# EAGLE schematic axiom_beta_shield_HDMI_v0.2.b03618a9 (EAGLE 7.7.0)
Assembly variants: Beta

## Sheet 1 of 2
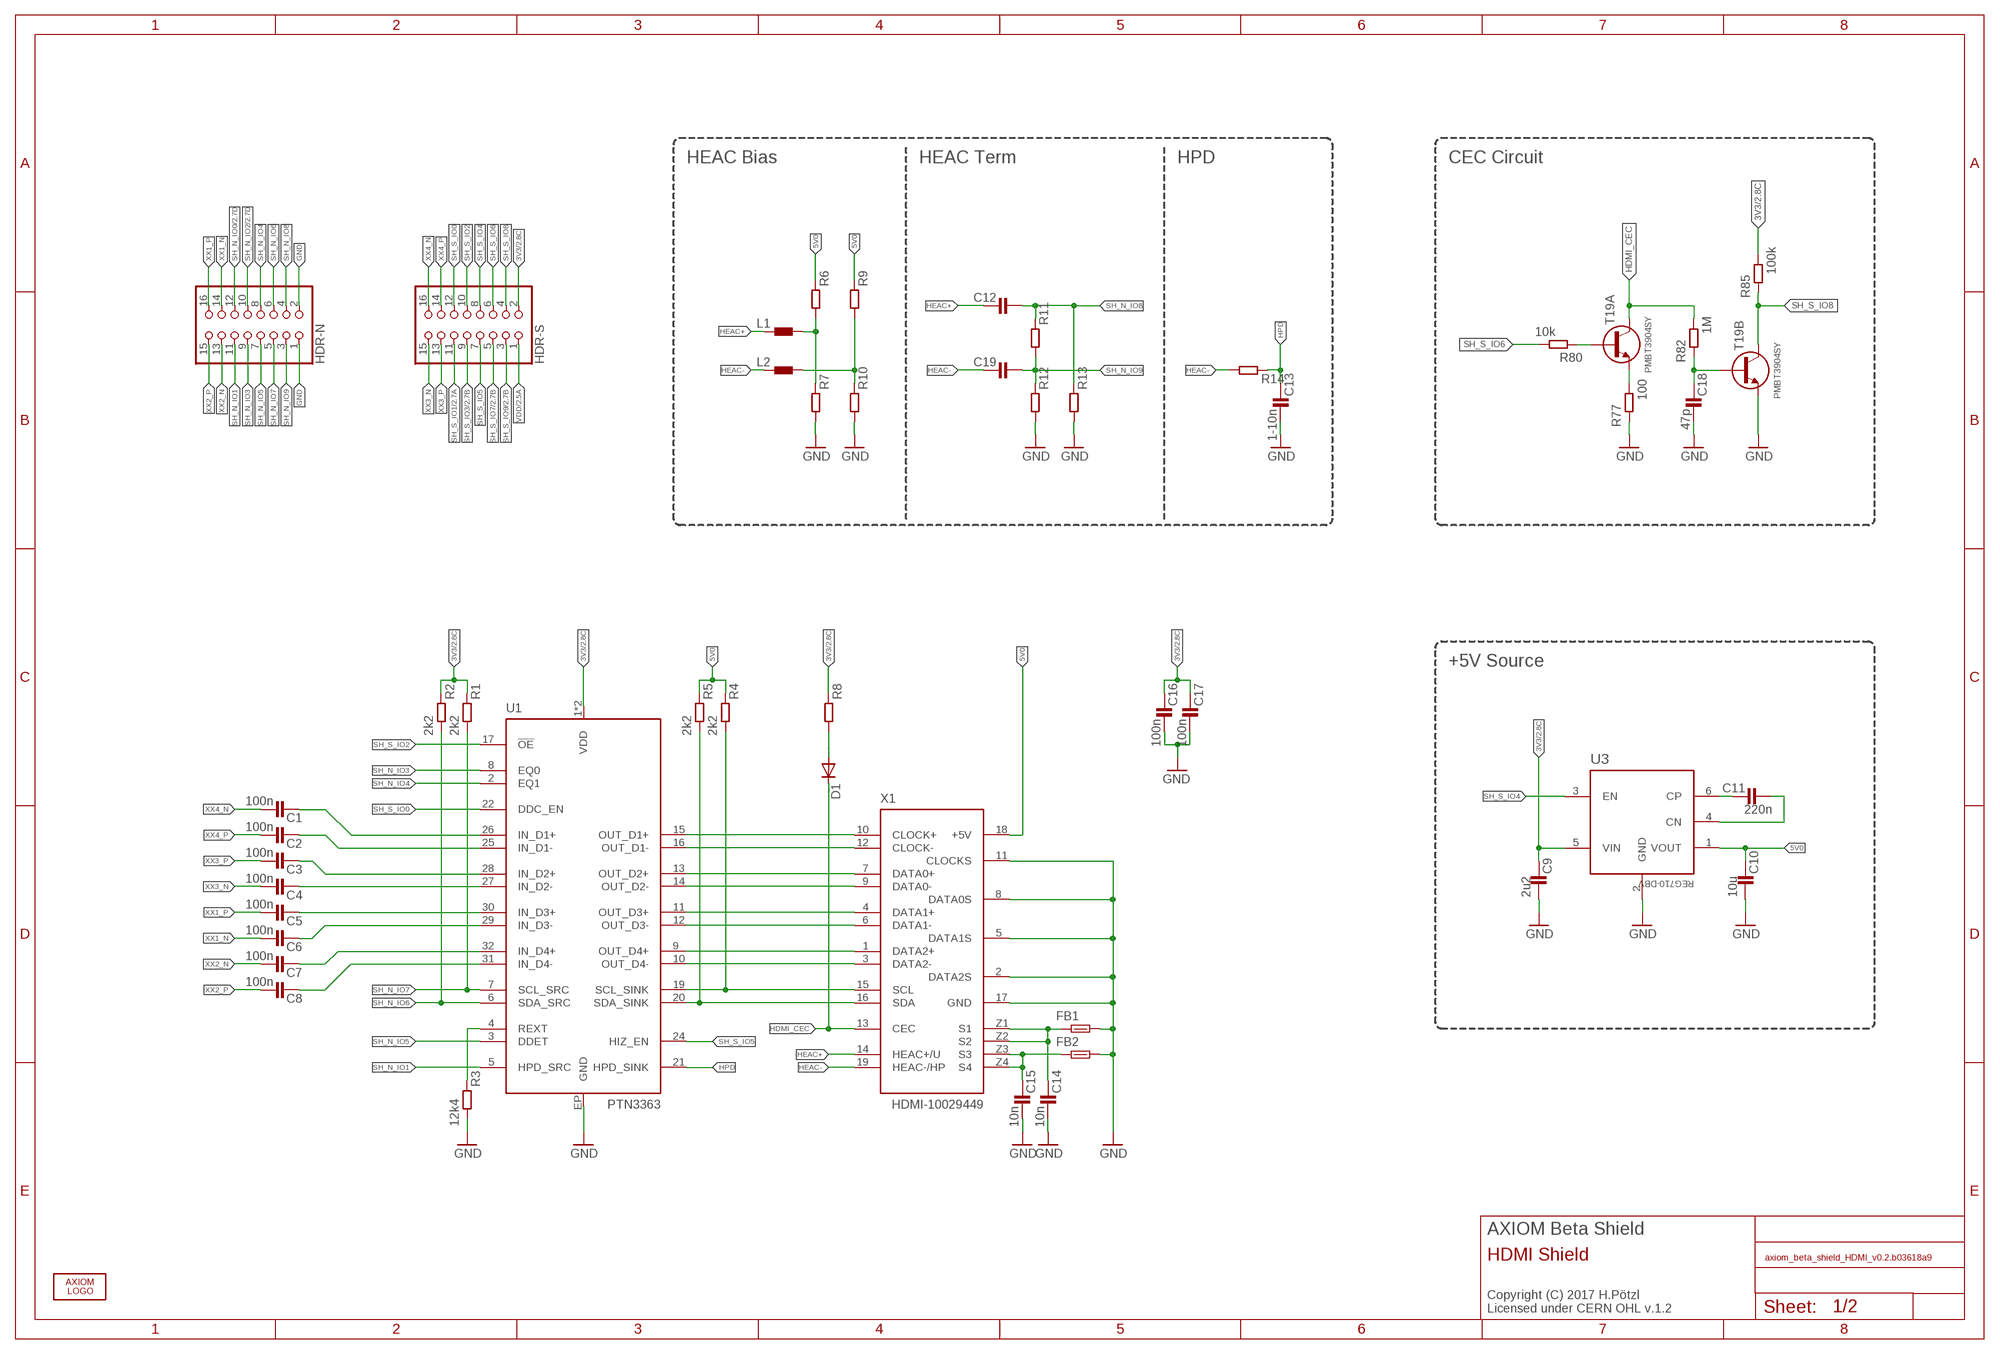
[diagram p0: schematic, sheet 1]

### Parts
C1  100n  C0402-C  [0402-C]
C2  100n  C0402-C  [0402-C]
C3  100n  C0402-C  [0402-C]
C4  100n  C0402-C  [0402-C]
C5  100n  C0402-C  [0402-C]
C6  100n  C0402-C  [0402-C]
C7  100n  C0402-C  [0402-C]
C8  100n  C0402-C  [0402-C]
C9  2u2  C0603-B  [0603-B]
C10  10u  C0603-B  [0603-B]
C11  220n  C0402-B  [0402-B]
C12  C0402-B  [0402-B]  (not fitted in variant Beta)
C13  1-10n  C0402-B  [0402-B]  (not fitted in variant Beta)
C14  10n  C0402-B  [0402-B]
C15  10n  C0402-B  [0402-B]
C16  100n  C0402-B  [0402-B]
C17  100n  C0402-B  [0402-B]
C18  47p  C0402-B  [0402-B]
C19  C0402-B  [0402-B]  (not fitted in variant Beta)
D1  DIODE-SOD523  [SOD523]
FB1  FB0603-B  [0603-B]
FB2  FB0603-B  [0603-B]
HDR-N  PINHD-2X08_2.00_SMD  [2X08M_SMD]  (not fitted in variant Beta)
HDR-S  PINHD-2X08_2.00_SMD  [2X08M_SMD]  (not fitted in variant Beta)
L1  L0402-B  [0402-B]  (not fitted in variant Beta)
L2  L0402-B  [0402-B]  (not fitted in variant Beta)
R1  2k2  R0402-B  [0402-B]
R2  2k2  R0402-B  [0402-B]
R3  12k4  R0402-B  [0402-B]
R4  2k2  R0402-B  [0402-B]
R5  2k2  R0402-B  [0402-B]
R6  R0402-B  [0402-B]  (not fitted in variant Beta)
R7  R0402-B  [0402-B]  (not fitted in variant Beta)
R8  R0402-B  [0402-B]
R9  R0402-B  [0402-B]  (not fitted in variant Beta)
R10  R0402-B  [0402-B]  (not fitted in variant Beta)
R11  R0402-B  [0402-B]  (not fitted in variant Beta)
R12  R0402-B  [0402-B]  (not fitted in variant Beta)
R13  R0402-B  [0402-B]  (not fitted in variant Beta)
R14  R0402-B  [0402-B]  (not fitted in variant Beta)
R77  100  R0402-B  [0402-B]
R80  10k  R0402-B  [0402-B]
R82  1M  R0402-B  [0402-B]
R85  100k  R0402-B  [0402-B]
T19  PMBT3904SY  [SOT363]
U1  PTN3363  [HVQFN32]
U3  REG710-DBV  [DBV]
U$1  AXIOM_LOGO459X70  [AXIOM_LOGO_459X70]
X1  HDMI-10029449  [10029449-X01XLF]

### Nets
3V3: C9.1 C16.1 C17.1 HDR-S.2 R1.1 R2.1 R8.1 R85.2 U1.1(VDD) U1.18(VDD) U3.5(VIN) ; also sheet 2
5V0: C10.1 R4.1 R5.1 R6.1 R9.1 U3.1(VOUT) X1.18(+5V)
CLOCK_N [LVDS]: U1.16(OUT_D1-) X1.12(CLOCK-)
CLOCK_P [LVDS]: U1.15(OUT_D1+) X1.10(CLOCK+)
DATA0_N [LVDS]: U1.14(OUT_D2-) X1.9(DATA0-)
DATA0_P [LVDS]: U1.13(OUT_D2+) X1.7(DATA0+)
DATA1_N [LVDS]: U1.12(OUT_D3-) X1.6(DATA1-)
DATA1_P [LVDS]: U1.11(OUT_D3+) X1.4(DATA1+)
DATA2_N [LVDS]: U1.10(OUT_D4-) X1.3(DATA2-)
DATA2_P [LVDS]: U1.9(OUT_D4+) X1.1(DATA2+)
GND: C9.2 C10.2 C13.2 C14.2 C15.2 C16.2 C17.2 C18.2 FB1.2 FB2.2 HDR-N.1 HDR-N.2 R3.2 R7.2 R10.2 R12.2 R13.2 R77.1 T19.4(B:E) U1.EP(GND) U3.2(GND) X1.2(DATA2S) X1.5(DATA1S) X1.8(DATA0S) X1.11(CLOCKS) X1.17(GND) ; also sheet 2
HDMI_CEC: D1.C R82.2 T19.6(A:C) X1.13(CEC)
HDMI_SCL: R4.2 U1.19(SCL_SINK) X1.15(SCL)
HDMI_SDA: R5.2 U1.20(SDA_SINK) X1.16(SDA)
HEAC+: C12.1 L1.1 X1.14(HEAC+/U)
HEAC-: C19.1 L2.1 R14.2 X1.19(HEAC-/HP)
HPD: C13.1 R14.1 U1.21(HPD_SINK)
IN_D1_N [LVDS]: C2.1 U1.25(IN_D1-)
IN_D1_P [LVDS]: C1.1 U1.26(IN_D1+)
IN_D2_N [LVDS]: C4.1 U1.27(IN_D2-)
IN_D2_P [LVDS]: C3.1 U1.28(IN_D2+)
IN_D3_N [LVDS]: C6.1 U1.29(IN_D3-)
IN_D3_P [LVDS]: C5.1 U1.30(IN_D3+)
IN_D4_N [LVDS]: C8.1 U1.31(IN_D4-)
IN_D4_P [LVDS]: C7.1 U1.32(IN_D4+)
N$1: L1.2 R6.2 R7.1
N$2: L2.2 R9.2 R10.1
N$23: C15.1 FB2.1 X1.Z3(S3) X1.Z4(S4)
N$24: C11.1 U3.6(CP)
N$25: C11.2 U3.4(CN)
N$26: C14.1 FB1.1 X1.Z1(S1) X1.Z2(S2)
N$27: R3.1 U1.4(REXT)
N$45: D1.A R8.2
N$100: R77.2 T19.1(A:E)
N$101: C18.1 R82.1 T19.5(B:B)
N$102: R80.1 T19.2(A:B)
SH_N_IO0: HDR-N.12 ; also sheet 2
SH_N_IO1: HDR-N.11 U1.5(HPD_SRC)
SH_N_IO2: HDR-N.10 ; also sheet 2
SH_N_IO3: HDR-N.9 U1.8(EQ0)
SH_N_IO4: HDR-N.8 U1.2(EQ1)
SH_N_IO5: HDR-N.7 U1.3(DDET)
SH_N_IO6: HDR-N.6 R2.2 U1.6(SDA_SRC)
SH_N_IO7: HDR-N.5 R1.2 U1.7(SCL_SRC)
SH_N_IO8: C12.2 HDR-N.4 R11.1 R13.1
SH_N_IO9: C19.2 HDR-N.3 R11.2 R12.1
SH_S_IO0: HDR-S.12 U1.22(DDC_EN)
SH_S_IO1: HDR-S.11 ; also sheet 2
SH_S_IO2: HDR-S.10 U1.17(!OE!)
SH_S_IO3: HDR-S.9 ; also sheet 2
SH_S_IO4: HDR-S.8 U3.3(EN)
SH_S_IO5: HDR-S.7 U1.24(HIZ_EN)
SH_S_IO6: HDR-S.6 R80.2
SH_S_IO7: HDR-S.5 ; also sheet 2
SH_S_IO8: HDR-S.4 R85.1 T19.3(B:C)
SH_S_IO9: HDR-S.3 ; also sheet 2
VDD: HDR-S.1 ; also sheet 2
XX1_N: C6.2 HDR-N.14
XX1_P: C5.2 HDR-N.16
XX2_N: C7.2 HDR-N.13
XX2_P: C8.2 HDR-N.15
XX3_N: C4.2 HDR-S.15
XX3_P: C3.2 HDR-S.13
XX4_N: C1.2 HDR-S.16
XX4_P: C2.2 HDR-S.14

### Notes on the sheet
- HEAC Bias | HEAC Term | HPD | CEC Circuit
- +5V Source
- AXIOM Beta Shield
- HDMI Shield
- Copyright (C) 2017 H.Pötzl
  Licensed under CERN OHL v.1.2

## Sheet 2 of 2
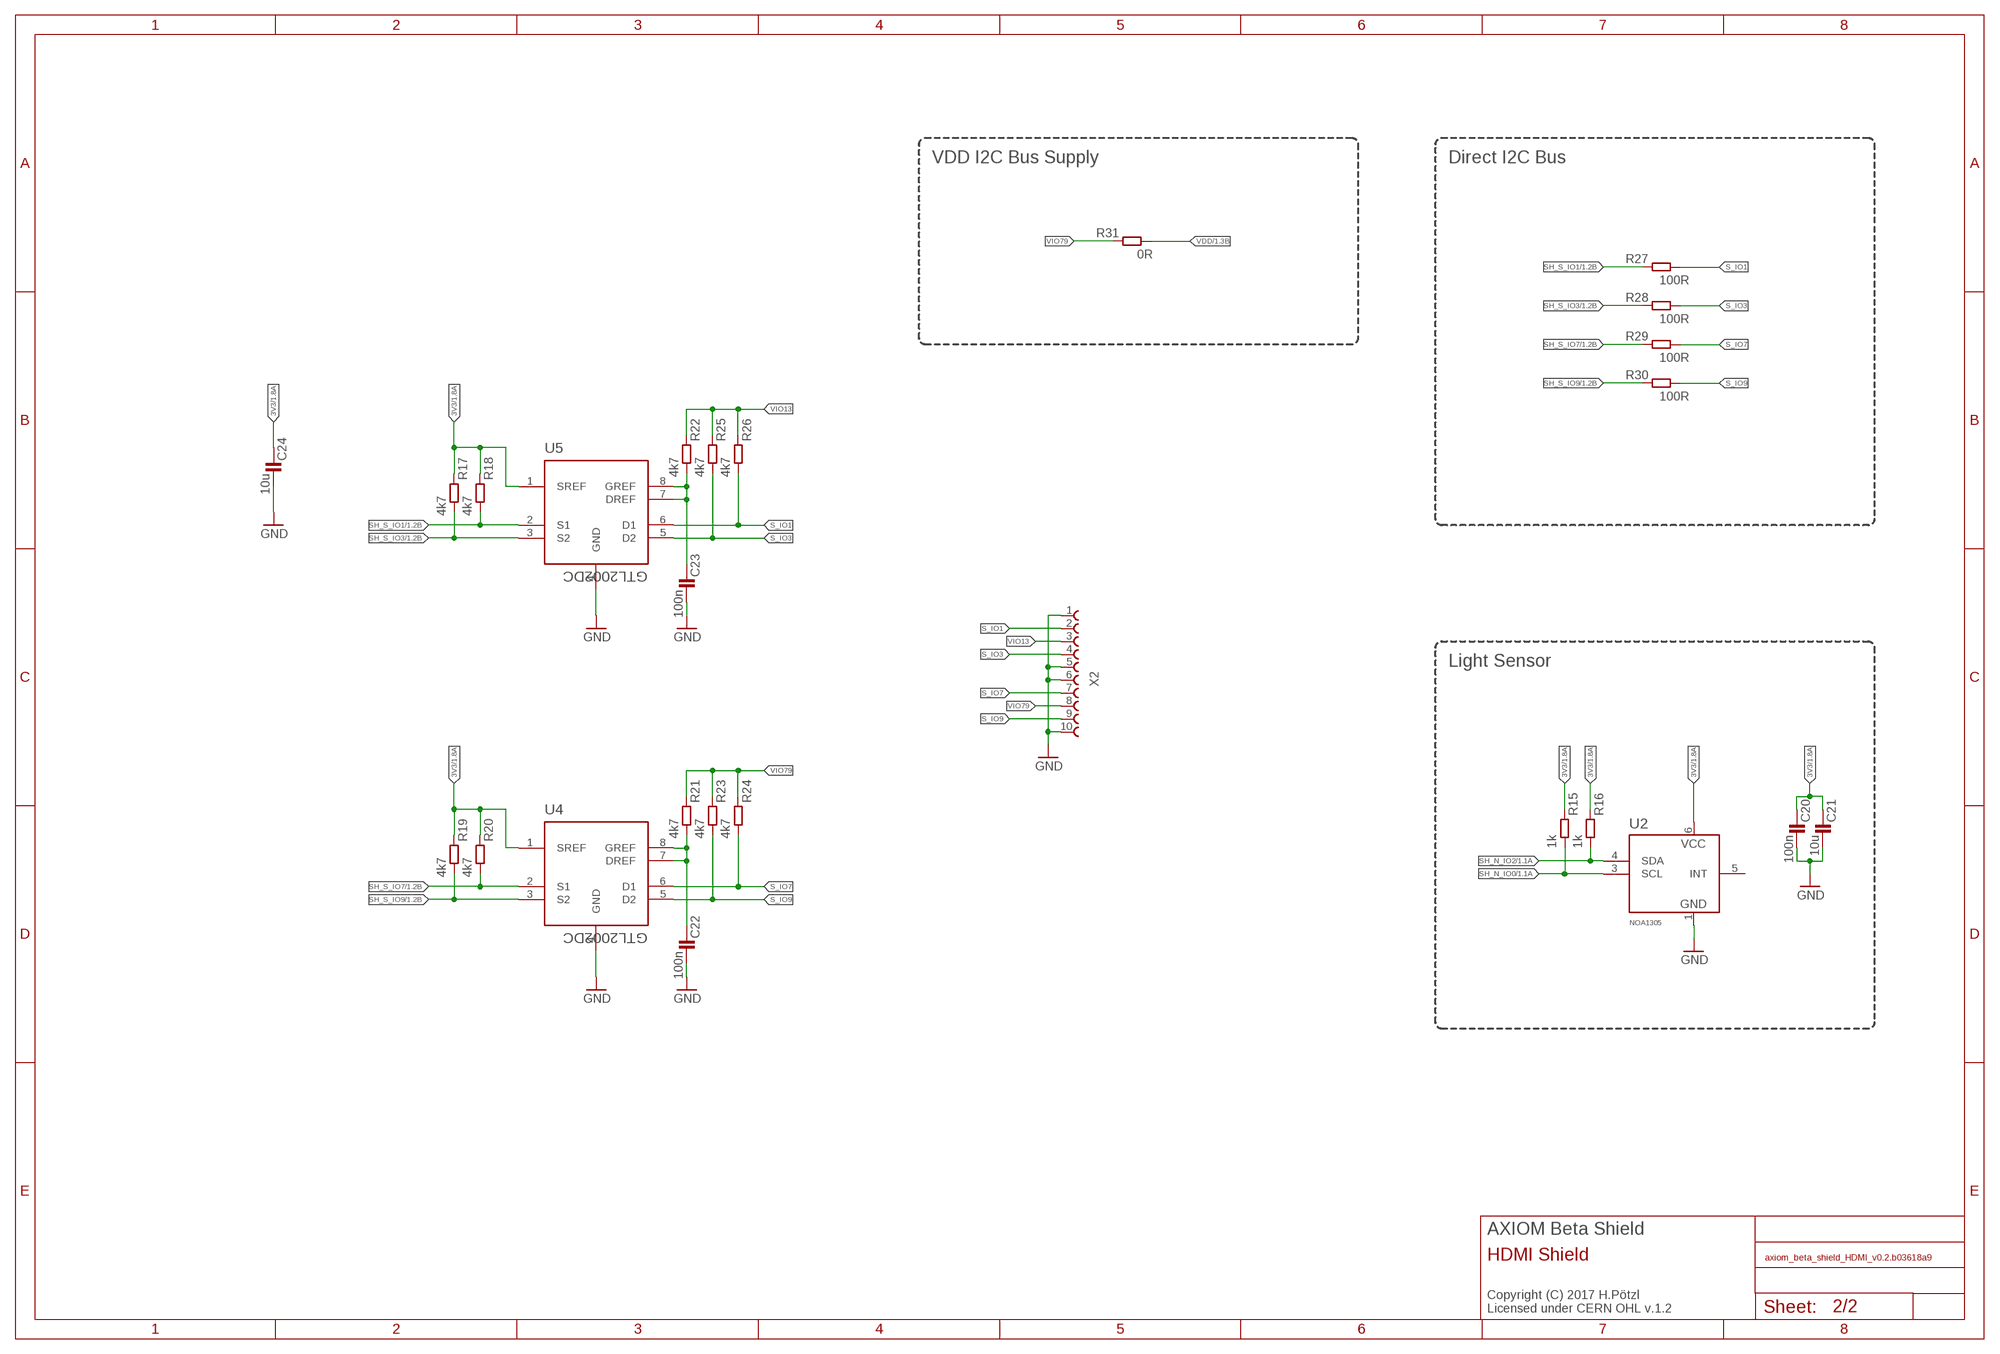
[diagram p1: schematic, sheet 2]

### Parts
C20  100n  C0402-B  [0402-B]
C21  10u  C0402-B  [0402-B]
C22  100n  C0402-B  [0402-B]
C23  100n  C0402-B  [0402-B]
C24  10u  C0402-B  [0402-B]
R15  1k  R0402-B  [0402-B]
R16  1k  R0402-B  [0402-B]
R17  4k7  R0402-B  [0402-B]
R18  4k7  R0402-B  [0402-B]
R19  4k7  R0402-B  [0402-B]
R20  4k7  R0402-B  [0402-B]
R21  4k7  R0402-B  [0402-B]
R22  4k7  R0402-B  [0402-B]
R23  4k7  R0402-B  [0402-B]
R24  4k7  R0402-B  [0402-B]
R25  4k7  R0402-B  [0402-B]
R26  4k7  R0402-B  [0402-B]
R27  100R  R0402-B  [0402-B]  (not fitted in variant Beta)
R28  100R  R0402-B  [0402-B]  (not fitted in variant Beta)
R29  100R  R0402-B  [0402-B]  (not fitted in variant Beta)
R30  100R  R0402-B  [0402-B]  (not fitted in variant Beta)
R31  0R  R0402-B  [0402-B]
U2  NOA1305  [CUDFN6]
U4  GTL2002DC  [VSSOP-8]
U5  GTL2002DC  [VSSOP-8]
X2  68711014022  [68711014022]

### Nets
3V3: C20.1 C21.1 C24.1 R15.1 R16.1 R17.1 R18.1 R19.1 R20.1 U2.6(VCC) U4.1(SREF) U5.1(SREF) ; also sheet 1
GND: C20.2 C21.2 C22.2 C23.2 C24.2 U2.1(VSS) U4.4(GND) U5.4(GND) X2.1 X2.5 X2.6 X2.10 ; also sheet 1
N$6: C22.1 R21.2 U4.7(DREF) U4.8(GREF)
N$7: C23.1 R22.2 U5.7(DREF) U5.8(GREF)
S_IO1: R26.2 R27.2 U5.6(D1) X2.2
S_IO3: R25.2 R28.2 U5.5(D2) X2.4
S_IO7: R24.2 R29.2 U4.6(D1) X2.7
S_IO9: R23.2 R30.2 U4.5(D2) X2.9
SH_N_IO0: R15.2 U2.3(SCL) ; also sheet 1
SH_N_IO2: R16.2 U2.4(SDA) ; also sheet 1
SH_S_IO1: R18.2 R27.1 U5.2(S1) ; also sheet 1
SH_S_IO3: R17.2 R28.1 U5.3(S2) ; also sheet 1
SH_S_IO7: R20.2 R29.1 U4.2(S1) ; also sheet 1
SH_S_IO9: R19.2 R30.1 U4.3(S2) ; also sheet 1
VDD: R31.2 ; also sheet 1
VIO13: R22.1 R25.1 R26.1 X2.3
VIO79: R21.1 R23.1 R24.1 R31.1 X2.8
Unconnected: U2.5(INT)

### Notes on the sheet
- VDD I2C Bus Supply | Direct I2C Bus
- Light Sensor
- AXIOM Beta Shield
- HDMI Shield
- Copyright (C) 2017 H.Pötzl
  Licensed under CERN OHL v.1.2

## Library data of the parts
C1-C24 = generic-rcl:C
D1 = diode:DIODE-: DIODE
FB1 FB2 = generic-rcl:FB
HDR-N HDR-S = pincon:PINHD-2X08: PIN HEADER
L1 L2 = generic-rcl:L
R1-R31 R77 R80 R82 R85 = generic-rcl:R
T19 = transistor:PMBT3904S: 40 V, dual NPN switching transistor Herbert Poetzl
U1 = ptn3363:PTN3363
U2 = noa1305:NOA1305: Ambient Light Sensor
U3 = reg710:REG710: Buck/Boost Charge Pump 60mA
U4 U5 = gtl2002:GTL2002: Bidirectional low voltage translator,SOIC-8
U$1 = logos_apertus_axiom:AXIOM_LOGO
X1 = hdmi:HDMI
X2 = eiCan_03_ZIF_Connectors_Flat_Flexible_Cable:68711014022: WR-FPC 0.5mm SMT ZIF Horizontal Top Contact, 10 Pins

## Net classes
0 default: width 0.152 mm, drill 0.203 mm, clearance 0.152 mm
1 power: width 0.203 mm, drill 0.254 mm, clearance 0.203 mm
2 LVDS: width 0.152 mm, drill 0.203 mm, clearance 0.152 mm